# Altium project ROB_450_NEAR.PrjPcb
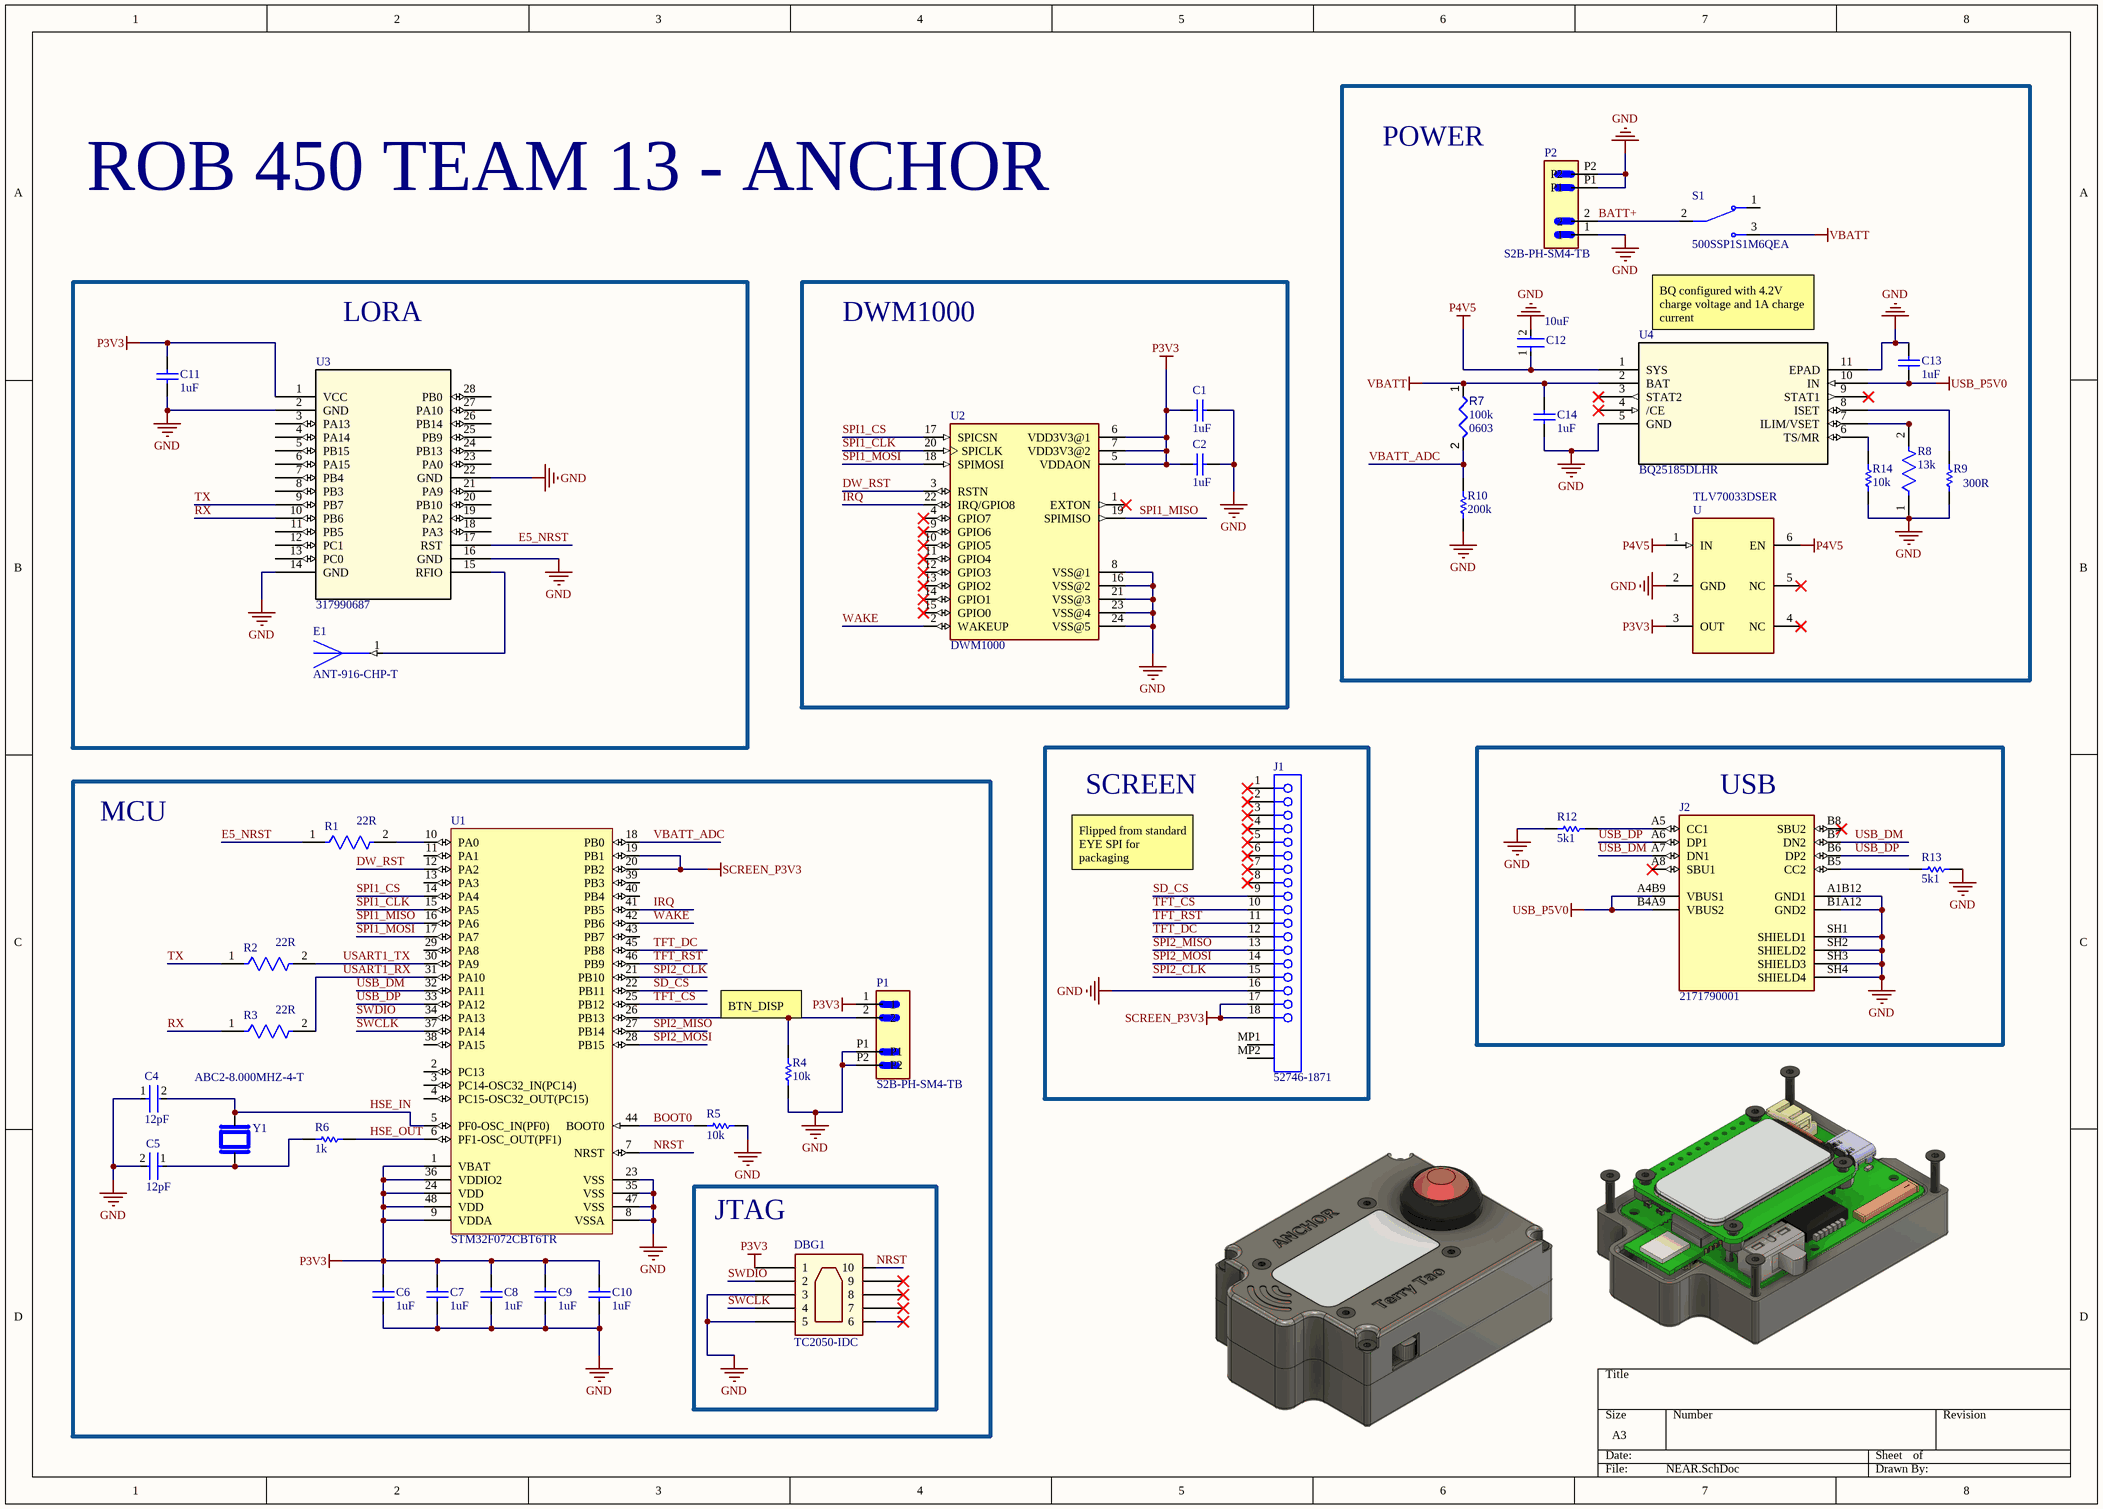
[diagram p0: NEAR.SchDoc]
1 sheet, 39 parts. Net scope: global (net labels, ports and power ports of the same name join across sheets).
Board file: NEAR.PcbDoc

## Sheet NEAR.SchDoc
size A3; SheetNumber: 1; SheetTotal: 1

### Parts
C1  1uF  [CAP_0603]
C2  1uF  [CAP_0603]
C4  12pF  [FP-C0603C-CF-MFG]
C5  12pF  [FP-C0603C-CF-MFG]
C6  1uF  [CAP_0603]
C7  1uF  [CAP_0603]
C8  1uF  [CAP_0603]
C9  1uF  [CAP_0603]
C10  1uF  [CAP_0603]
C11  1uF  [CAP_0603]
C12  10uF  [FP-GRM188-0_1-e0_2_0_55-IPC_A]
C13  1uF  [CAP_0603]
C14  1uF  [CAP_0603]
DBG1  TC2050-IDC  [TC2050-IDC-Footprint-2]
E1  ANT-916-CHP-T  [XDCR_ANT-916-CHP-T]
J1  52746-1871  [MOLX-52746-1871]
J2  2171790001  [MOLEX_2171790001]
P1  S2B-PH-SM4-TB  [JST_S2B-PH-SM4-TB]
P2  S2B-PH-SM4-TB  [JST_S2B-PH-SM4-TB]
R1  22R  [FP-CPF0603-MFG]
R2  22R  [FP-CPF0603-MFG]
R3  22R  [FP-CPF0603-MFG]
R4  10k  [RESC1609X55X30LL15T15]
R5  10k  [RESC1609X55X30LL15T15]
R6  1k  [RESC1608X55X30LL15T15]
R7  Case/Package: 0603  [RESC1608X55X25ML10T15]  (hidden comment: 100k)
R8  13k  [FP-ERA3A-IPC_A]
R9  300R  [RESC1608X55X30ML15T15]
R10  200k  [RESC1608X55X25LL10T15]
R12  5k1  [RESC1608X55X25ML10T15]
R13  5k1  [RESC1608X55X25ML10T15]
R14  10k  [RESC1609X55X30LL15T15]
S1  500SSP1S1M6QEA  [SW_500SSP1S1M6QEA]
U  TLV70033DSER  [SON50P150X150X80-6N]
U1  STM32F072CBT6TR  [STM-LQFP48_M]
U2  DWM1000  [XCVR_DWM1000]
U3  317990687  [QFN_90687_SEE]
U4  BQ25185DLHR  [WSON10_DLH_TEX]
Y1  ABC2-8.000MHZ-4-T  [XTAL_ABC2-8.000MHZ-4-T]

### Blocks framed on the sheet
POWER: C12-C14 P2 R7-R10 R14 S1 U U4
LORA: C11 E1 U3
DWM1000: C1 C2 U2
SCREEN: J1
USB: J2 R12 R13
MCU: C4-C10 P1 R1-R6 U1 Y1
JTAG: DBG1

### Nets
GND: C1.2 C2.2 C4.1 C5.2 C6.1 C7.1 C8.1 C9.1 C10.1 C11.1 C12.2 C13.2 C14.1 DBG1.3 DBG1.5 J1.16 J2.A1B12(GND1) J2.B1A12(GND2) J2.SH1(SHIELD1) J2.SH2(SHIELD2) J2.SH3(SHIELD3) J2.SH4(SHIELD4) P1.P1 P1.P2 P2.1 P2.P1 P2.P2 R4.1 R5.1 R8.1 R9.2 R10.2 R12.2 R13.1 R14.1 U.2(GND) U1.8(VSSA) U1.23(VSS) U1.35(VSS) U1.47(VSS) U2.8(VSS@1) U2.16(VSS@2) U2.21(VSS@3) U2.23(VSS@4) U2.24(VSS@5) U3.2(GND) U3.14(GND) U3.16(GND) U3.22(GND) U4.5(GND) U4.11(EPAD)
P3V3: C1.1 C2.1 C6.2 C7.2 C8.2 C9.2 C10.2 C11.2 DBG1.1 P1.1 U.3(OUT) U1.1(VBAT) U1.9(VDDA) U1.24(VDD) U1.36(VDDIO2) U1.48(VDD) U2.5(VDDAON) U2.6(VDD3V3@1) U2.7(VDD3V3@2) U3.1(VCC)
P4V5: C12.1 U.1(IN) U.6(EN) U4.1(SYS)
SCREEN_P3V3: J1.17 J1.18 U1.19(PB1) U1.20(PB2)
USB_P5V0: C13.1 J2.A4B9(VBUS1) J2.B4A9(VBUS2) U4.10(IN)
VBATT: C14.2 R7.1 S1.3(NO) U4.2(BAT)
BATT+: P2.2 S1.2(COM)
BOOT0: R5.2 U1.44(BOOT0)
DW_RST: U1.12(PA2) U2.3(RSTN)
E5_NRST: R1.1 U3.17(RST)
HSE_IN: C4.2 U1.5(PF0-OSC_IN(PF0)) Y1.2 Y1.3
HSE_OUT: R6.1 U1.6(PF1-OSC_OUT(PF1))
IRQ: U1.41(PB5) U2.22(IRQ/GPIO8)
NRST: DBG1.10 U1.7(NRST)
RX: R3.1 U3.10(PB6)
SD_CS: J1.9 U1.22(PB11)
SPI1_CLK: U1.15(PA5) U2.20(SPICLK)
SPI1_CS: U1.14(PA4) U2.17(SPICSN)
SPI1_MISO: U1.16(PA6) U2.19(SPIMISO)
SPI1_MOSI: U1.17(PA7) U2.18(SPIMOSI)
SPI2_CLK: J1.15 U1.21(PB10)
SPI2_MISO: J1.13 U1.27(PB14)
SPI2_MOSI: J1.14 U1.28(PB15)
SWCLK: DBG1.4 U1.37(PA14)
SWDIO: DBG1.2 U1.34(PA13)
TFT_CS: J1.10 U1.25(PB12)
TFT_DC: J1.12 U1.45(PB8)
TFT_RST: J1.11 U1.46(PB9)
TX: R2.1 U3.9(PB7)
USART1_RX: R3.2 U1.31(PA10)
USART1_TX: R2.2 U1.30(PA9)
USB_DM: J2.A7(DN1) J2.B7(DN2) U1.32(PA11)
USB_DP: J2.A6(DP1) J2.B6(DP2) U1.33(PA12)
VBATT_ADC: R7.2 R10.1 U1.18(PB0)
WAKE: U1.42(PB6) U2.2(WAKEUP)
NetC5_1: C5.1 R6.2 Y1.1 Y1.4
NetE1_1: E1.1(FEED) U3.15(RFIO)
NetJ2_A5: J2.A5(CC1) R12.1
NetJ2_B5: J2.B5(CC2) R13.2
NetP1_2: P1.2 R4.2 U1.26(PB13)
NetR1_2: R1.2 U1.10(PA0)
NetR8_2: R8.2 U4.7(ILIM/VSET)
NetR9_1: R9.1 U4.8(ISET)
NetR14_2: R14.2 U4.6(TS/MR)

Not connected (* = marked no-connect by the designer): DBG1 6* 7* 8* 9*; J1 1* 2* 3* 4* 5* 6* 7* 8* MP1 MP2; J2 A8(SBU1)* B8(SBU2)*; S1 1(NC); U 4(NC)* 5(NC)*; U1 2(PC13) 3(PC14-OSC32_IN(PC14)) 4(PC15-OSC32_OUT(PC15)) 11(PA1) 13(PA3) 29(PA8) 38(PA15) 39(PB3) 40(PB4) 43(PB7); U2 1(EXTON)* 4(GPIO7)* 9(GPIO6)* 10(GPIO5)* 11(GPIO4)* 12(GPIO3)* 13(GPIO2)* 14(GPIO1)* 15(GPIO0)*; U3 3(PA13) 4(PA14) 5(PB15) 6(PA15) 7(PB4) 8(PB3) 11(PB5) 12(PC1) 13(PC0) 18(PA3) 19(PA2) 20(PB10) 21(PA9) 23(PA0) 24(PB13) 25(PB9) 26(PB14) 27(PA10) 28(PB0); U4 3(STAT2)* 4(/CE)* 9(STAT1)*

### Notes on the sheet
- ROB 450 TEAM 13 - ANCHOR
- BQ configured with 4.2V charge voltage and 1A charge current
- Flipped from standard EYE SPI for packaging
- (near R4) BTN_DISP

### Library data of the parts
C1 C2 C6-C11 C13 C14 = CMP-001-00097-1: Cap Ceramic 1uF 25V X7R 10% Pad SMD 0603 125C Automotive T/R; Voltage Rating: 25V; Case/Package: 0603; Capacitance: 1uF; Dielectric: X7R; Tolerance: 10%
C4 C5 = CMP-2006-03703-3: Ceramic Capacitor 12Pf 50V, C0G, 5%, 0603, Full Reel; Manufacturer: KEMET; Manufacturer Part Number: C0603C120J5GACTU; Automotive Grade: Grade 1; Temperature Coefficient: 30ppm/°C; Tolerance: 0.05; Temperature Range High: +125°C; Temperature Characteristic: C0G; Temperature Range Low: -55°C; Voltage Rating: 50 V; Mouser Description: Ceramic Capacitor 12Pf 50V, C0G, 5%, 0603, Full Reel; Package: C0603C-CF; Temperature: -55°C to +125°C; Device Class L3: Ceramic Capacitors; Value: 12 pF; Material: Ceramic; Lead Free: Yes; ComponentLink2URL: https://api.kemet.com/component-edge/download/datasheet/C0603C100J5GACAUTO.pdf; Category: Cap; Capacitance: 12 pF; ComponentLink2Description: Datasheet; Device Class L1: Passive Components; Height: 0.87mm; Device Class L2: Capacitors; Digikey Description: Ceramic Capacitor 12Pf 50V, C0G, 5%, 0603, Full Reel; RoHS: TRUE; Octopart: https://octopart.com/c0603c120j5gactu-kemet-108780; Automotive: Yes
C12 = CMP-2006-02792-2: Chip Multilayer Ceramic Capacitors for General Purpose, 0603, 10uF, X5R, 15%, 20%, 6.3V; Packaging: Tape and Reel; Voltage Rating (DC): 6.3V; Width: 0.031inch; Termination: SMD/SMT; Dielectric: X5R; Package Quantity: 4000; Voltage Rating: 6.3V; Capacitance: 10uF; Case/Package: 0603; Min Operating Temperature: -55°C; Voltage: 6.3V; Length: 1.6mm; Thickness: 0.035inch; Lead Free: Lead Free; Depth: 0.8mm; Case Code (Imperial): 0603; Max Operating Temperature: 85°C; Material: Ceramic; Height: 0.8mm; Tolerance: 20%; Mount: Surface Mount; REACH SVHC: No SVHC; Radiation Hardening: No; Case Code (Metric): 1608
DBG1 = CMP-002-00071-4: CBL PLUG-OF-NAILS 10-PIN W/LEGS
E1 = CMP-00025-00008-1: 915 MHz Monopole Ceramic Chip Antenna; MF: Linx Technologies; Design Item ID: ANT-916-CHP-T; Price: None; Case/Package: None; Availability: In Stock; MP: ANT-916-CHP-T; Pins: 1; Value: *; Component Type: Standard; Source: ANT-916-CHP-T.SchLib; SnapEDA_Link: https://www.snapeda.com/parts/ANT-916-CHP-T/Linx/view-part/168085/?ref=snap; Check_prices: https://www.snapeda.com/parts/ANT-916-CHP-T/Linx/view-part/168085/?ref=eda
J1 = CMP-1241-00380-1: 0.5 mm Pitch Easy-On(TM) Type FPC Connector, 2.0 mm Mated Height, Right Angle, ZIF, SMT, Bottom Contact, 18 Circuits, -20 to 85 degC, ELV and RoHS Compliant, Tape and Reel; Manufacturer: Molex; Voltage (Max): 50V; Durability (mating cycles max): 20; PCB Locator: No; Circuits (Loaded): 18; Pitch - Mating Interface: 0.50mm; Polarized to PCB: Yes; Entry Angle: 90degrees Angle; Material - Metal: Phosphor Bronze; Material - Plating Termination: Gold; Mated Height: 2.00mm; Current (Max per Contact): 0.5A; PartNumber: 52746-1871; ComponentLink3URL: http://www.molex.com/pdm_docs/sd/527461871_sd.pdf; ComponentLink2Description: Datasheet; ComponentLink1URL: http://www.molex.com/molex/index.jsp; Mounting Technology: Surface Mount; RoHS: TRUE; Packing: Tape and Reel; ComponentLink2URL: http://www.molex.com/webdocs/datasheets/pdf/en-us/0527461871_FFC_FPC_CONNECTORS.pdf; Contact Position: Bottom; Orientation: Right Angle; PackageDescription: 18-Lead FPC Connector, Pitch 0.5 mm; ComponentLink3Description: Package Specification; ComponentLink1Description: Manufacturer URL; Stackable: No; PCB Retention: Yes; PackageReference: 52746-1871; Number of Rows: 1; PackageVersion: Rev. H, 05/2009; Material - Plating Mating: Gold
J2 = CMP-002-00656-1: USB Type C - Connector, Top-mount SMT, 16pos; MP: 217179-0001; MF: Molex; Check_prices: https://www.snapeda.com/parts/217179-0001/Molex/view-part/?ref=eda; Design Item ID: 2171790001; Value: *; Source: 2171790001.SchLib; Case/Package: None; SnapEDA_Link: https://www.snapeda.com/parts/217179-0001/Molex/view-part/?ref=snap
P1 P2 = CMP-002-00662-3: Connector Header Surface Mount, Right Angle 2 position 0.079 (2.00mm); MF: JST Sales; Design Item ID: S2B-PH-SM4-TB; Case/Package: None; Value: *; Pins: 2; Availability: In Stock; SnapEDA_Link: https://www.snapeda.com/parts/S2B-PH-SM4-TB/JST+Sales+America+Inc./view-part/?ref=snap; Component Type: Standard; Check_prices: https://www.snapeda.com/parts/S2B-PH-SM4-TB/JST+Sales+America+Inc./view-part/?ref=eda; Purchase-URL: https://pricing.snapeda.com/search/part/S2B-PH-SM4-TB/?ref=eda; Source: S2B-PH-SM4-TB.SchLib; Price: None; MP: S2B-PH-SM4-TB
R1-R3 = CMP-03211-007811-1: RES SMD 22Ω 0.1% 1/16W 0603; Manufacturer: TE Connectivity; Manufacturer Part Number: CPF0603B22RE1; Temperature Coefficient: 25ppm/°C; Power Rating: 0.063W; Voltage Rating: 50V; Automotive: No; ComponentLink2Description: Datasheet; Package: CPF0603; Temperature Range High: +155°C; Device Class L1: Passive Components; Resistance: 22Ω; Device Class L3: Chip SMD Resistors; packaging: 1k Reel; Temperature: -55°C to +155°C; Octopart: https://octopart.com/cpf0603b22re1-te+connectivity-9539398; ComponentLink2URL: https://www.te.com/commerce/DocumentDelivery/DDEController?Action=showdoc&DocId=Data+Sheet%7F1773200%7FM%7Fpdf%7FEnglish%7FENG_DS_1773200_M.pdf%7F3-1676481-2; Value: 22Ω; Device Class L2: Resistors; Height: 0.55mm; RoHS: TRUE; Composition: Thin Film; Lead Free: Yes; octopart_url: https://octopart.com/cpf0603b22re1-te+connectivity-9539398; Tolerance: 0.1%; Ipc Land Pattern Name: RESC15580X45; Category: Res; Temperature Range Low: -55°C; Series: CPF
R4 R5 R14 = CMP-1012-00623-3: Chip Resistor, 10 KOhm, +/- 1%, 0.1 W, -55 to 155 degC, 0603 (1608 Metric), RoHS, Tape and Reel; Manufacturer: Panasonic; Voltage Rating: 75V; Case\/Package: 0603; Power Rating: 100mW; Resistance: 10KOhm; Temperature Coefficient: 100ppm\/degreesC; Number of Pins: 2; Package Reference: 603; Depth: 0.8mm; Mount: SurfaceMount; Package Description: 2-Pin Surface Mount Device, Body 1.6 x 0.85 mm; Datasheet Version: 02/2017; Length: 1.6mm; Lead Free: LeadFree; Height: 0.45mm; Number of Terminations: 2; Max Power Dissipation: 100mW; Min Operating Temperature: -55degC; Datasheet URL: https://industrial.panasonic.com/cdbs/www-data/pdf/RDA0000/AOA0000C304.pdf; Termination: SMD/SMT; Case Code (Metric): 1608; Case Code (Imperial): 0603; Tolerance: 1%; Max Operating Temperature: 155degC; RoHSCompliant: true; Voltage Rating (DC): 75V; Radiation Hardening: No; Packaging: TapeandReel; Composition: ThickFilm; Mounting Technology: SurfaceMount; Manufacturer URL: http://www.panasonic.com/; Width: 0.031inch; REACH SVHC: NoSVHC; Contact Plating: Tin; Military Standard: Not; Package Quantity: 1
R6 = CMP-2000-00180-1: Part Number: ERJ-3EKF1001V; Manufacturer: Panasonic
R7 = CMP-009-00023-4: Chip Resistor, 100 KOhm, +/- 1%, 0.1 W, -55 to 155 degC, 0603 (1608 Metric); Power: 100mW; Voltage Rating: 50V; Max Operating Temperature: 155°C; Min Operating Temperature: -55°C; RoHS Compliant: True; Pins: 2; Value: 100k; Mounting Technology: SM; Tolerance: 1%
R8 = CMP-2000-00907-2: RES SMD 13K OHM 0.1% 1/10W 0603; Resistance: 13kR; Voltage Rating (DC): 75V; Power Rating: 100mW; Temperature Coefficient: 25ppm/°C; Technology: THIN FILM; Case Code (Metric): 1608; Case Code (Imperial): 0603; Number of Terminations: 2; Number of Pins: 2; Construction: Rectangular; Military Standard: Not; Resistor Type: Metal Film; Length: 1.6mm; Case/Package: 0603; Height: 0.45mm; Width: 0.8mm; RoHS Compliant: Yes; Contact Plating: Tin; Resistance Tolerance: 0.1%; Packaging: Tape and Reel; Tolerance: 0.1%; Mount: Surface Mount; Termination: SMD/SMT; Max Power Dissipation: 100mW; Voltage Rating: 75V; Features: Automotive AEC-Q200; Min Operating Temperature: -55°C; Radiation Hardening: No; Lead Free: Lead Free; Package Quantity: 1; REACH SVHC: No SVHC; Max Operating Temperature: 155°C; Depth: 0.8mm; Series: ERA-3A
R9 = CMP-2000-00766-1: ERJ-3GEYJ301V; Manufacturer: Panasonic; Part Number: ERJ-3GEYJ301V
R10 = CMP-2000-04252-1: Manufacturer: Yageo; Part Number: RC0603JR-07200KL
R12 R13 = CMP-2000-04091-1: Manufacturer: Yageo; Part Number: RC0603FR-075K1L
S1 = CMP-011-00014-1: Slide Switch SPDT Through Hole, Right Angle; MF: E-Switch; Design Item ID: 500SSP1S1M6QEA; Digi-Key_Part_Number: EG2478-ND; Check_prices: https://www.snapeda.com/parts/500SSP1S1M6QEA/E-Switch/view-part/?ref=eda; Pins: 3; Source: 500SSP1S1M6QEA.SchLib; Component Type: Standard; Case/Package: None; Value: *; SnapEDA_Link: https://www.snapeda.com/parts/500SSP1S1M6QEA/E-Switch/view-part/?ref=snap; Purchase-URL: https://pricing.snapeda.com/search/part/500SSP1S1M6QEA/?ref=eda; MP: 500SSP1S1M6QEA
U = CMP-019-00083-5: Linear Voltage Regulator IC 1 Output 200mA 6-WSON _1.5x1.5_; MF: Texas Instruments; Case/Package: WFDFN-6 Texas Instruments; SnapEDA_Link: https://www.snapeda.com/parts/TLV70033DSER/Texas%20Instruments/view-part/562119/?ref=snap; Component Type: Standard; MP: TLV70033DSER; Value: *; Availability: Unavailable; Source: SnapEDAsch.SchLib; Design Item ID: TLV70033DSER; Pins: 4; Price: None
U1 = CMP-0304-00171-1: ARM Cortex-M0 32-bit MCU, 128 KB Flash, 16 KB Internal RAM, 37 I/Os, 48-Pin LQFP, -40 to 85 degC, Tape and Reel; FLASH Size (Prog) (kB): 128; D/A Converter: 1; Operating Frequency(F) (Processor speed) (MHz): 48; Supply Voltage(Vcc) min (V): 2; I/Os (High Current): 37; Internal RAM Size (kB): 16; ComponentLink1URL: http://www.st.com/; DatasheetVersion: Rev. 5; Mounting Technology: Surface Mount; Packing: Tape and Reel; ComponentLink2Description: Datasheet; ComponentLink2URL: http://www.st.com/st-web-ui/static/active/en/resource/technical/document/datasheet/DM00090510.pdf; ComponentLink1Description: Manufacturer URL; Package Reference: LQFP48; Core: ARM Cortex-M0; Package Description: 48-Pin Low Profile Quad Flat Package, Body 7 x 7 mm, Pitch 0.5 mm
U2 = CMP-236-000000-2: 802.15.4 IR-UWB Transceiver Module 3.5GHz ~ 6.5GHz Integrated, Chip Surface Mount; MF: Decawave Limited; Package: Module Decawave; Source: SnapEDAsch.SchLib; Availability: Unavailable; Component Type: Standard; Price: None; Value: *; SnapEDA_Link: https://www.snapeda.com/parts/DWM1000/Decawave%20Limited/view-part/327593/?ref=snap; MP: DWM1000; Pin Count: 24; Design Item ID: DWM1000
U3 = CMP-031-00023-1: No Description Available; Mfr_Name: BeagleBoard; Type: Type; Design Item ID: 317990687; Source: 317990687.SchLib; RefDes: RefDes
U4 = CMP-019-00082-1: No Description Available; Mfr_Name: Texas Instruments; RefDes: RefDes; Design Item ID: BQ25185DLHR; Type: Power Management; Source: BQ25185DLHR.SchLib
Y1 = CMP-003-00037-3: LOW FREQUENCY CERAMIC SURFACE MOUNT MICROPROCESSOR CRYSTAL; MF: Abracon; SnapEDA_Link: https://www.snapeda.com/parts/ABC2-8.000MHZ-4-T/Abracon/view-part/?ref=snap; Availability: In Stock; MP: ABC2-8.000MHZ-4-T; Value: *; Component Type: Standard; Pins: 4; Price: None; Purchase-URL: https://pricing.snapeda.com/search/part/ABC2-8.000MHZ-4-T/?ref=eda; Design Item ID: ABC2-8.000MHZ-4-T; Case/Package: SMD-4 Abracon; Source: ABC2-8.000MHZ-4-T.SchLib; Check_prices: https://www.snapeda.com/parts/ABC2-8.000MHZ-4-T/Abracon/view-part/?ref=eda